# Altium schematic sheet DDR_VREF.SchDoc
size A4
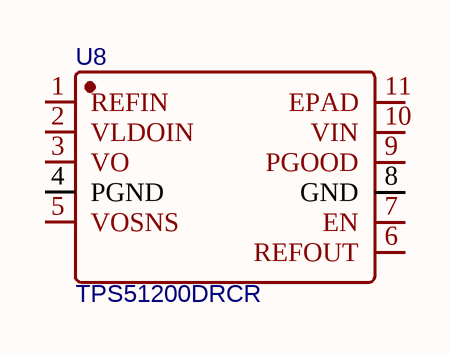
[diagram p0: DDR_VREF.SchDoc]

## Parts
U8  TPS51200DRCR  [WSON-10_L3.0-W3.0-P0.50-BL-EP]

## Nets

Not connected (* = marked no-connect by the designer): U8 1(REFIN) 2(VLDOIN) 3(VO) 4(PGND) 5(VOSNS) 6(REFOUT) 7(EN) 8(GND) 9(PGOOD) 10(VIN) 11(EPAD)

## Library data of the parts
U8 = TPS51200DRCR: BOM_Manufacturer: TI; Contributor: LCSC; BOM_Supplier: LCSC; BOM_Manufacturer Part: TPS51200DRCR; BOM_Supplier Part: C34771; spicePre: U; spiceSymbolName: TPS51200DRCR